# EAGLE design encoder (EAGLE 6.5.0)
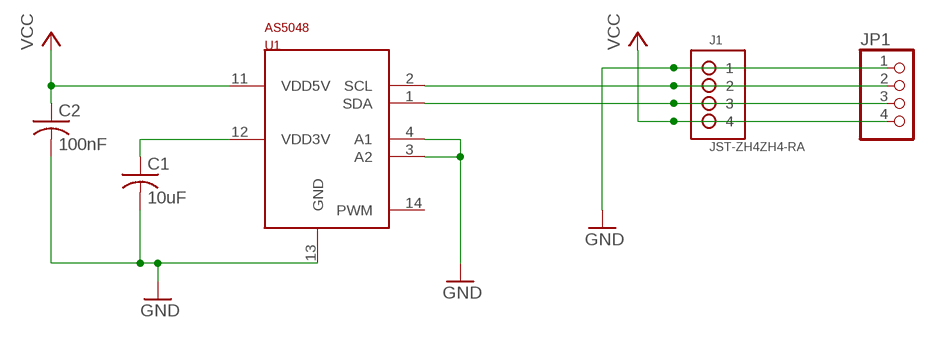
[diagram p0: schematic, sheet 1]

## Parts
C1  10uF  C-USC0603  [C0603]
C2  100nF  C-USC0603  [C0603]
J1  JST-ZH4ZH4-RA  [JST_ZH4_RA]
JP1  PINHD-1X4  [1X04]
U1  AS5048BTSSOP14  [TSSOP14]

## Nets
GND: C1.2 C2.2 J1.1 JP1.1 U1.3(A2) U1.4(A1) U1.13(GND)
N$1: C1.1 U1.12(VDD3V)
N$2: J1.2 JP1.2 U1.2(SCL)
N$3: J1.3 JP1.3 U1.1(SDA)
VCC: C2.1 J1.4 JP1.4 U1.11(VDD5V)
Unconnected: U1.14(PWM)

## Library data of the parts
C1 C2 = rcl:C-US: CAPACITOR, American symbol
J1 = encoder:JST-ZH4
JP1 = pinhead:PINHD-1X4: PIN HEADER
U1 = encoder:AS5048B

## Board
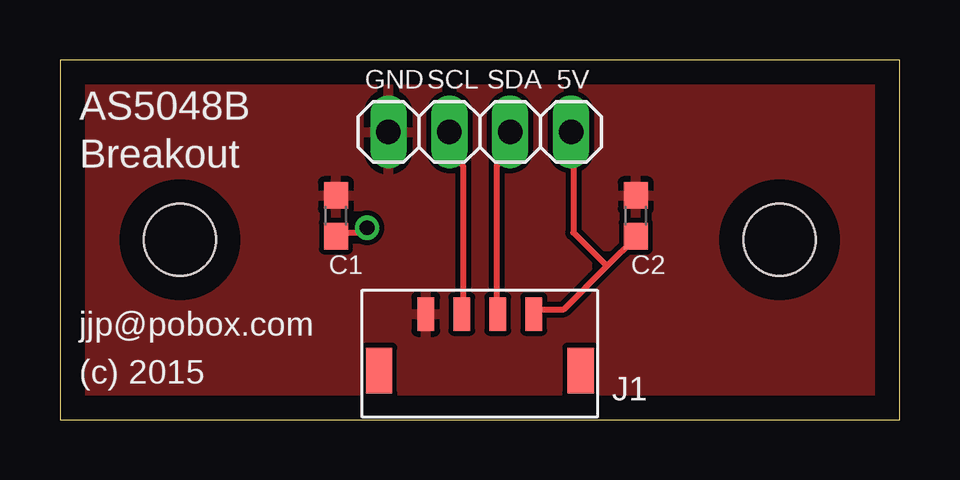
[diagram p1: board, top side]
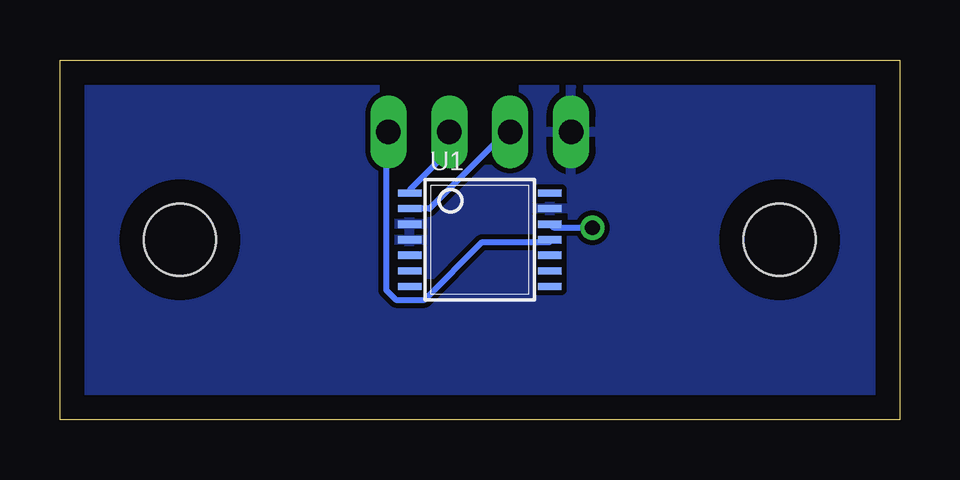
[diagram p2: board, bottom side, seen from below]

Size 35 x 15 mm. Coordinates in mm from the lower left corner, seen from the top.
Outline: 0,0 35,0 35,15 0,15 0,0
Copper layers (1*16): Top 0.035mm / dielectric 1.5mm / Bottom 0.035mm
Design rules "default": minimum track width 10mil, minimum drill 24mil, track to track 8mil, track to pad 8mil, pad to pad 8mil, via to via 8mil, smd to smd 8mil, copper to edge 40mil, drill to drill 8mil, minimum pad ring 10mil, minimum via ring 8mil, stop-mask expansion 4mil, vias tented up to drill 0mil, thermal gap 10mil
Holes 3 mm at 5,7.5 30,7.5

### Footprints (pad centres in the part's own frame; a part is rotated, then mirrored left to right if it is on the bottom)
C0603 = smd 1.1 x 1: 1 -0.85,0; 2 0.85,0
JST_ZH4_RA = smd 0.7 x 1.4: 1 2.25,0; 2 0.75,0; 3 -0.75,0; 4 -2.25,0 | smd 1.1 x 1.9: SHLD1 -4.2,2.35; SHLD2 4.2,2.35
1X04 = drill 1.016 long: 1 -3.81,0; 2 -1.27,0; 3 1.27,0; 4 3.81,0
TSSOP14 = smd 0.305 x 0.991: 1 -1.95,-2.918; 2 -1.3,-2.918; 3 -0.65,-2.918; 4 0,-2.918; 5 0.65,-2.918; 6 1.3,-2.918; 7 1.95,-2.918; 8 1.95,2.918; 9 1.3,2.918; 10 0.65,2.918; 11 0,2.918; 12 -0.65,2.918; 13 -1.3,2.918; 14 -1.95,2.918

### Placement (x,y rotation side)
C1  11.5,8.5 90 top
C2  24,8.5 90 top
J1  17.5,4.4 180 top
JP1  17.5,12 0 top
U1  17.5,7.5 270 bottom

### Tracks (layer width: path | path; a pad name or v marks a point on that pad's centre or on a via)
GND
  pour Top: 0.3,0.3 34.7,0.3 34.7,14.7 0.3,14.7
  pour Bottom: 0.3,0.3 34.7,0.3 34.7,14.7 0.3,14.7
N$1  (via drill 0.61)
  Top 0.254: v12.8,8 12.6,7.8 11.6,7.8 C1.1
  Bottom 0.254: v12.8,8 14.4,8 U1.12
N$2
  Top 0.254: J1.2 16.8,4.4 16.8,10.6 16.4,11 16.4,12 JP1.2
  Bottom 0.254: U1.2 19.6,8.8 16.4,12 JP1.2
N$3
  Top 0.254: J1.3 18.2,4.4 18.2,10.6 18.6,11 18.6,12 JP1.3
  Bottom 0.254: U1.1 20.4,9.6 18.8,11.2 18.8,12 JP1.3
VCC
  Top 0.254: 22.8,6.4 21,4.6 19.8,4.6 19.8,4.4 J1.4 | 22.8,6.4 24,7.6 C2.1 | 22.8,6.4 21.4,7.8 21.4,12 JP1.4
  Bottom 0.254: U1.11 14.6,7.4 17.4,7.4 19.8,5 21,5 21.4,5.4 21.4,12 JP1.4

### Text on the board
tPlace: GND | SCL | SDA | 5V | AS5048B | Breakout | jjp@pobox.com | (c) 2015